# Altium schematic sheet fpga_flash_debug.SchDoc
size A4
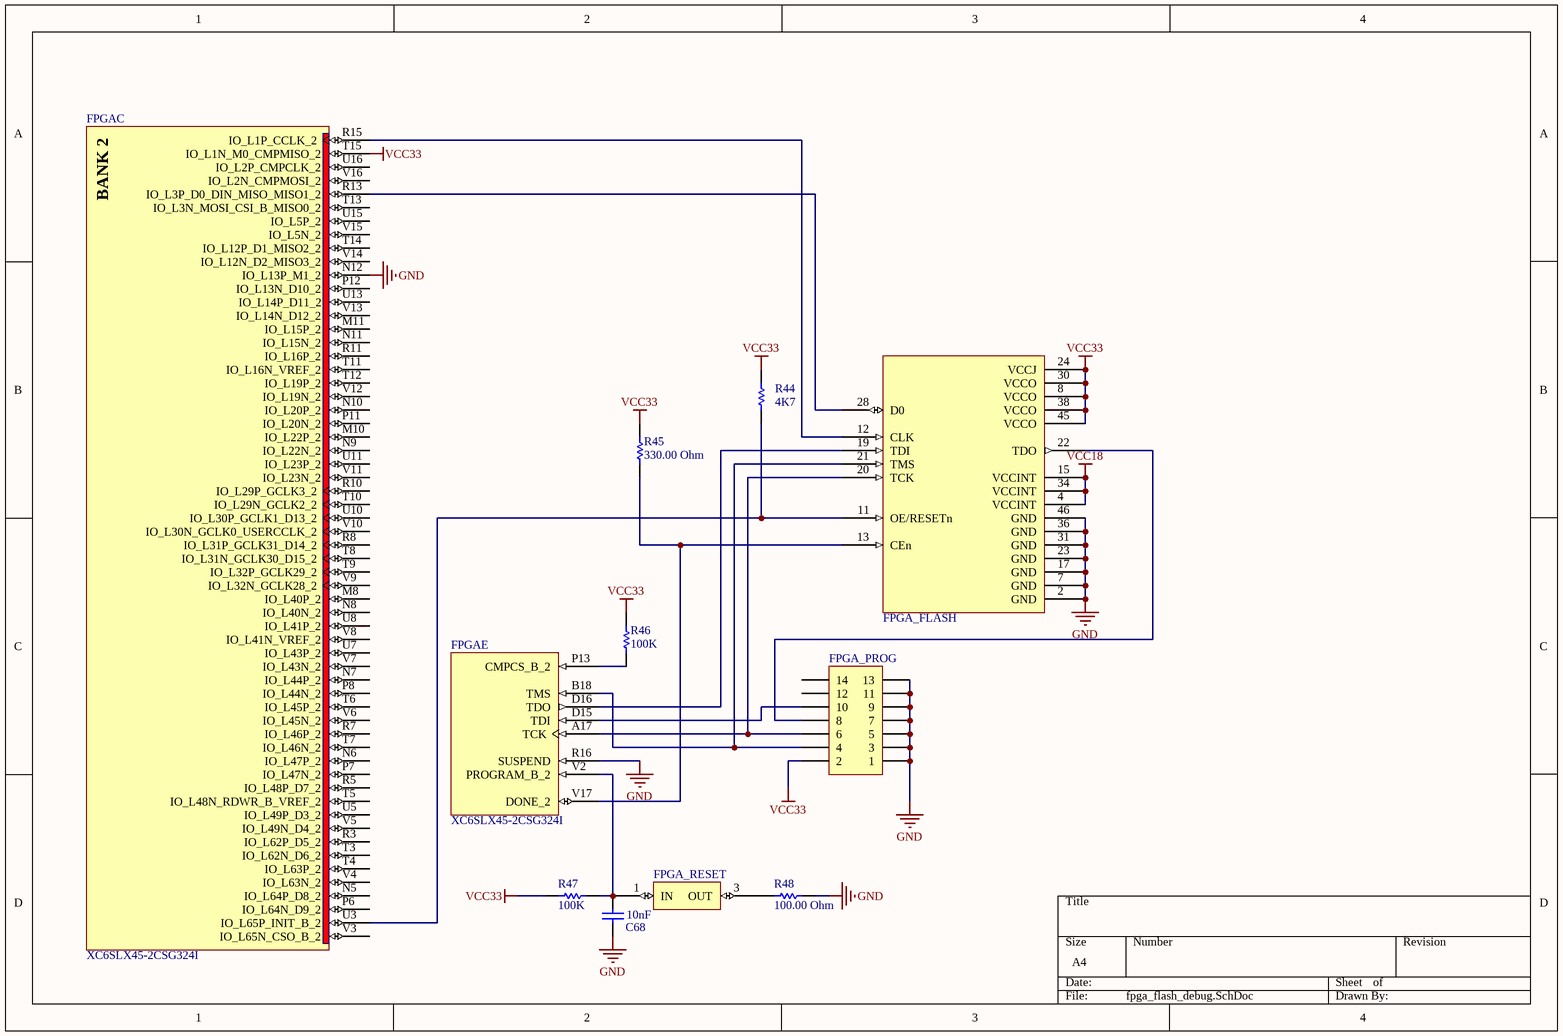
[diagram p0: fpga_flash_debug.SchDoc]

## Parts
C68  10nF  [CAPC0805(2012)75_N]
FPGA  XC6SLX45-2CSG324I  [CSG324]  (parts C,E of 8)
FPGA_FLASH  XCF16PVOG48C  [FPGA_FLASH]  (value not drawn)
FPGA_PROG  Header 7X2  [HDR2X7]  (value not drawn)
FPGA_RESET  BUTTON  [BUTTON]  (value not drawn)
R44  4K7  [RESC0805(2012)_M]
R45  330.00 Ohm  [RESC0805(2012)_M]
R46  100K  [RESC0805(2012)_L]
R47  100K  [RESC0805(2012)_L]
R48  100.00 Ohm  [RESC0805(2012)_M]

## Nets
GND: C68.1 FPGA.N12(IO_L13P_M1_2) FPGA.R16(SUSPEND) FPGA_FLASH.2(GND) FPGA_FLASH.7(GND) FPGA_FLASH.17(GND) FPGA_FLASH.23(GND) FPGA_FLASH.31(GND) FPGA_FLASH.36(GND) FPGA_FLASH.46(GND) FPGA_PROG.1 FPGA_PROG.3 FPGA_PROG.5 FPGA_PROG.7 FPGA_PROG.9 FPGA_PROG.11 FPGA_PROG.13 R48.2
VCC18: FPGA_FLASH.4(VCCINT) FPGA_FLASH.15(VCCINT) FPGA_FLASH.34(VCCINT)
VCC33: FPGA.T15(IO_L1N_M0_CMPMISO_2) FPGA_FLASH.8(VCCO) FPGA_FLASH.24(VCCJ) FPGA_FLASH.30(VCCO) FPGA_FLASH.38(VCCO) FPGA_FLASH.45(VCCO) FPGA_PROG.2 R44.1 R45.1 R46.2 R47.2
NetC68_2: C68.2 FPGA.V2(PROGRAM_B_2) FPGA_RESET.1(IN) R47.1
NetFPGA_A17: FPGA.A17(TCK) FPGA_FLASH.20(TCK) FPGA_PROG.6
NetFPGA_B18: FPGA.B18(TMS) FPGA_FLASH.21(TMS) FPGA_PROG.4
NetFPGA_D15: FPGA.D15(TDI) FPGA_PROG.10
NetFPGA_D16: FPGA.D16(TDO) FPGA_FLASH.19(TDI)
NetFPGA_FLASH_22: FPGA_FLASH.22(TDO) FPGA_PROG.8
NetFPGA_P13: FPGA.P13(CMPCS_B_2) R46.1
NetFPGA_R13: FPGA.R13(IO_L3P_D0_DIN_MISO_MISO1_2) FPGA_FLASH.28(D0)
NetFPGA_R15: FPGA.R15(IO_L1P_CCLK_2) FPGA_FLASH.12(CLK)
NetFPGA_RESET_3: FPGA_RESET.3(OUT) R48.1
NetFPGA_U3: FPGA.U3(IO_L65P_INIT_B_2) FPGA_FLASH.11(OE/RESETn) R44.2
NetFPGA_V17: FPGA.V17(DONE_2) FPGA_FLASH.13(CEn) R45.2

Not connected (* = marked no-connect by the designer): FPGA M8(IO_L40P_2) M10(IO_L22P_2) M11(IO_L15P_2) N5(IO_L64P_D8_2) N6(IO_L47P_2) N7(IO_L44P_2) N8(IO_L40N_2) N9(IO_L22N_2) N10(IO_L20P_2) N11(IO_L15N_2) P6(IO_L64N_D9_2) P7(IO_L47N_2) P8(IO_L44N_2) P11(IO_L20N_2) P12(IO_L13N_D10_2) R3(IO_L62P_D5_2) R5(IO_L48P_D7_2) R7(IO_L46P_2) R8(IO_L31P_GCLK31_D14_2) R10(IO_L29P_GCLK3_2) R11(IO_L16P_2) T3(IO_L62N_D6_2) T4(IO_L63P_2) T5(IO_L48N_RDWR_B_VREF_2) T6(IO_L45P_2) T7(IO_L46N_2) T8(IO_L31N_GCLK30_D15_2) T9(IO_L32P_GCLK29_2) T10(IO_L29N_GCLK2_2) T11(IO_L16N_VREF_2) T12(IO_L19P_2) T13(IO_L3N_MOSI_CSI_B_MISO0_2) T14(IO_L12P_D1_MISO2_2) U5(IO_L49P_D3_2) U7(IO_L43P_2) U8(IO_L41P_2) U10(IO_L30P_GCLK1_D13_2) U11(IO_L23P_2) U13(IO_L14P_D11_2) U15(IO_L5P_2) U16(IO_L2P_CMPCLK_2) V3(IO_L65N_CSO_B_2) V4(IO_L63N_2) V5(IO_L49N_D4_2) V6(IO_L45N_2) V7(IO_L43N_2) V8(IO_L41N_VREF_2) V9(IO_L32N_GCLK28_2) V10(IO_L30N_GCLK0_USERCCLK_2) V11(IO_L23N_2) V12(IO_L19N_2) V13(IO_L14N_D12_2) V14(IO_L12N_D2_MISO3_2) V15(IO_L5N_2) V16(IO_L2N_CMPMOSI_2); FPGA_PROG 12 14

## Notes on the sheet
- (in symbol XC6SLX45-2CSG324I, part C) BANK 2

## Library data of the parts
C68 = CMP-1036-03842-1: CAP 10nF 50V ±10% 0805 (2012 Metric) Thickness 0.75mm SMD; Case-Metric: 2012; Case-EIA: 0805; Value: 10nF; Max Thickness: 0.75 mm; Rated Voltage: 50 V; Tolerance: ±10%; Technology: SMT
FPGA = XC6SLX45-2CSG324I: Spartan-6 LX 1.2V FPGA, 218 User I/Os, 324-Ball Chip-Scale BGA (0.8mm Pitch), Speed Grade 2, Industrial Grade, Pb-Free; DatasheetVersion: ver1.6, Nov-2010; PackageVersion: ver1.1, Nov-2009; PackageReference: CSG324; PackageDescription: 324-Ball Chip-Scale BGA (CSG324) Package, 0.8 mm Pitch; Code_JEDEC: MO-275-KKAC-1; ComponentLink1Description: Manufacturer URL; ComponentLink1URL: http://www.xilinx.com/; ComponentLink2Description: Spartan-6 Datasheet; ComponentLink2URL: http://www.xilinx.com/support/documentation/data_sheets/ds160.pdf; ComponentLink3Description: Spartan-6 Documents; ComponentLink3URL: http://www.xilinx.com/support/documentation/spartan-6.htm
FPGA_PROG = Header 7X2: Header, 7-Pin, Dual row; LatestRevisionDate: 17-Jul-2002; LatestRevisionNote: Re-released for DXP Platform.; Publisher: Altium Limited
R44 = CMP-1013-00586-1: 4K7 0.125W 1% 0805 (2012 Metric)  SMD; Value: 4700.00 Ohm; Case-EIA: 0805; Case-Metric: 2012; Power: 0.125 W; Tolerance: 1 %; Technology: SMT
R45 = CMP-1013-00454-1: 330R 0.125W 1% 0805 (2012 Metric)  SMD; Case-EIA: 0805; Case-Metric: 2012; Value: 330.00 Ohm; Power: 0.125 W; Tolerance: 1 %; Technology: SMT
R46 R47 = CMP-1013-00122-1: 100K 0.125W 5% 0805 (2012 Metric)  SMD; Case-Metric: 2012; Value: 100000.00 Ohm; Case-EIA: 0805; Tolerance: 5 %; Technology: SMT; Power: 0.125 W
R48 = CMP-1013-00050-1: 100R 0.125W 5% 0805 (2012 Metric)  SMD; Case-EIA: 0805; Case-Metric: 2012; Tolerance: 5 %; Power: 0.125 W; Technology: SMT; Value: 100.00 Ohm